# EAGLE design dimmer (EAGLE 7.7.0)
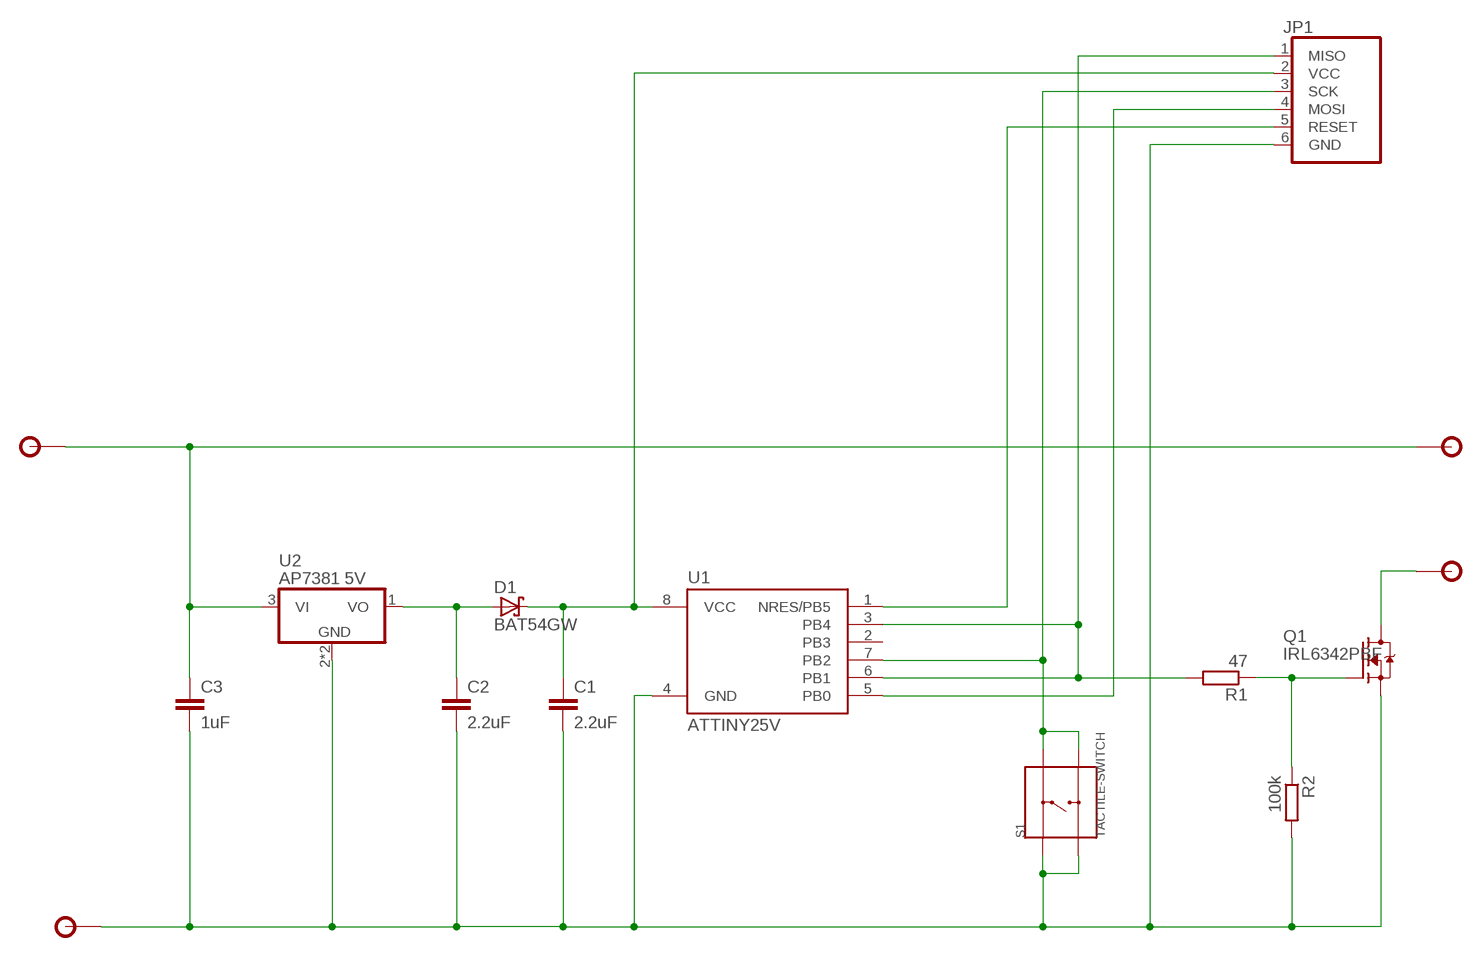
[diagram p0: schematic, sheet 1]

## Parts
C1  2.2uF  C-EUC0805  [C0805]
C2  2.2uF  C-EUC0805  [C0805]
C3  1uF  C-EUC0805  [C0805]
D1  BAT54GW  SCHOTKY  [SOD123FL]
JP1  AVR-ISP-6PIN  [2X03]
Q1  IRL6342PBF  [SO-8]
R1  47  R-EU_R0805  [R0805]
R2  100k  R-EU_R0805  [R0805]
S1  TACTILE-SWITCH  [SW4-SMD-4.5MM]
U1  ATTINY25V  ATTINY25V-10S  [SOIC8_EIAJ_208MIL]
U2  AP7381 5V  AP7381  [SOT89]
X1  PAD  [PAD-L]
X2  PAD  [PAD-L]
X3  PAD  [PAD-L]
X4  PAD  [PAD-L]

## Nets
BTN: JP1.3(SCK) S1.P$2(A1) S1.P$4(B1) U1.7(PB2)
GND: C1.2 C2.2 C3.2 JP1.6(GND) Q1.1(S) Q1.2(S) Q1.3(S) R2.2 S1.P$1(A0) S1.P$3(B0) U1.4(GND) U2.2(GND) U2.2@1(GND) X2.P$1
N$2: C2.1 D1.A U2.1(VO)
N$7: JP1.4(MOSI) U1.5(PB0)
N$8: JP1.5(RESET) U1.1(NRES/PB5)
N$10: Q1.4(G) R1.1 R2.1
OUT: Q1.5(D) Q1.6(D) Q1.7(D) Q1.8(D) X4.P$1
PWM: JP1.1(MISO) R1.2 U1.3(PB4) U1.6(PB1)
V+: C3.1 U2.3(VI) X1.P$1 X3.P$1
VCC: C1.1 D1.C JP1.2(VCC) U1.8(VCC)
Unconnected: U1.2(PB3)

## Library data of the parts
C1-C3 = rcl:C-EU: CAPACITOR, European symbol
D1 = cube:SCHOTKY
JP1 = cube:AVR-ISP-6PIN
Q1 = cube:IRL6342PBF
R1 R2 = rcl:R-EU_: RESISTOR, European symbol
S1 = cube:TACTILE-SWITCH
U1 = _hhn_attiny25_45_85:ATTINY25*: ATMEL ATtiny 25 Packages: P = PDIP 08 30mil S = SOIC 08 EIAJ 208mil SS = SOIC 08 JEDEC 150mil Technologies Note: for complete ordering code (temp. range, finish, tape&reel etc.) see www.atmel.com • Supply Voltage: V = (1.8…5.5)V | [blank] = (2.7…5.5)V • Speed: 10 = 10 MHz | 20 = 20 MHz Author: Dipl.-Ing. FH Rainer Bayer HHN Hochschule Heilbronn (Heilbronn University), rainer.bayer@hs-heilbronn.de Ingenieurbüro ing-rb, mail@ing-rb.de
U2 = cube:AP7381
X1-X4 = cube:PAD

## Board
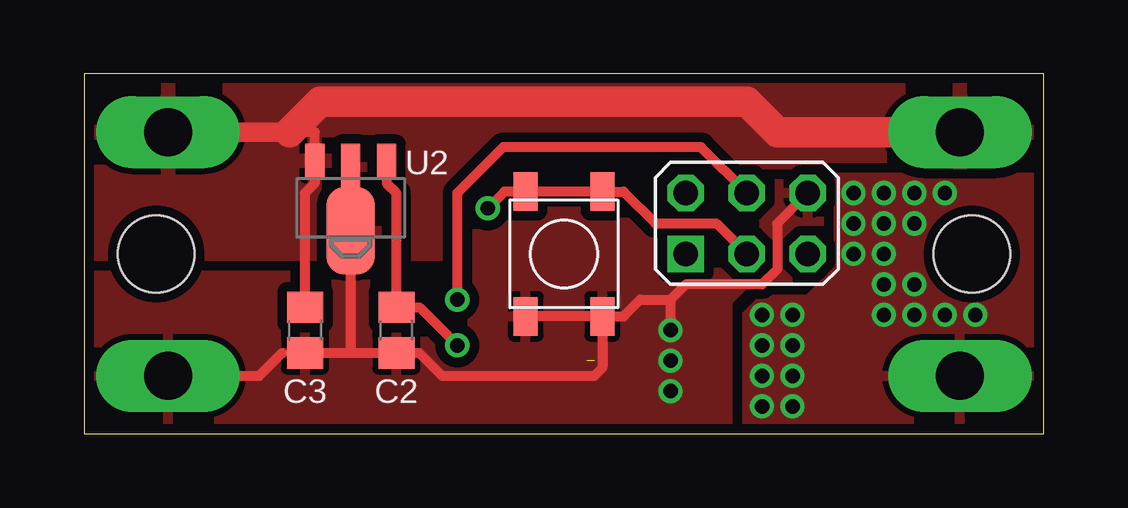
[diagram p1: board, top side]
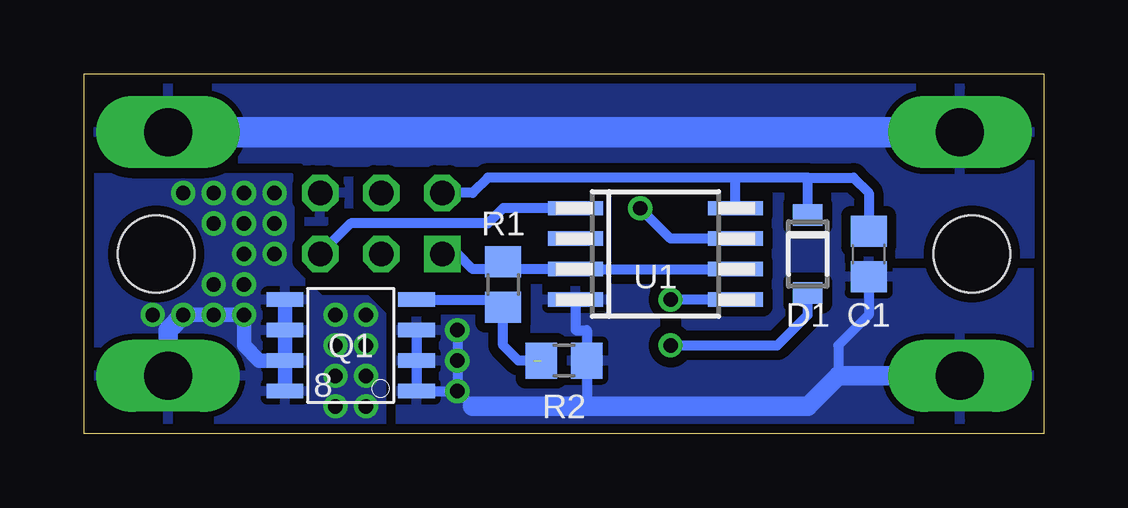
[diagram p2: board, bottom side, seen from below]

Size 40 x 15 mm. Coordinates in mm from the lower left corner, seen from the top.
Outline: 0,0 40,0 40,15 0,15 0,0
Copper layers (1*16): Top 0.035mm / dielectric 1.5mm / Bottom 0.035mm
Design rules "default *": minimum track width 5mil, minimum drill 0.3mm, track to track 5mil, track to pad 10mil, pad to pad 10mil, via to via 5mil, smd to smd 5mil, copper to edge 0.4mm, drill to drill 8mil, minimum pad ring 10mil, minimum via ring 8mil, stop-mask expansion 4mil, vias tented up to drill 0mil, thermal gap 10mil
Holes 3.2 mm at 37,7.5 3,7.5

### Footprints (pad centres in the part's own frame; a part is rotated, then mirrored left to right if it is on the bottom)
C0805 = smd 1.3 x 1.5: 1 -0.95,0; 2 0.95,0
SOD123FL = smd 0.91 x 1.22: A 1.625,0; C -1.625,0
2X03 = drill 1.016 square: 1 -2.54,-1.27 | drill 1.016 octagon: 2 -2.54,1.27; 3 0,-1.27; 4 0,1.27; 5 2.54,-1.27; 6 2.54,1.27
SO-8 = smd 1.524 x 0.61: 1 -2.743,1.905; 2 -2.743,0.635; 3 -2.743,-0.635; 4 -2.743,-1.905; 5 2.743,-1.905; 6 2.743,-0.635; 7 2.743,0.635; 8 2.743,1.905
R0805 = smd 1.3 x 1.5: 1 -0.95,0; 2 0.95,0
SW4-SMD-4.5MM = smd 1.6 x 1: P$1 -2.6,1.6; P$2 2.6,1.6; P$3 -2.6,-1.6; P$4 2.6,-1.6
SOIC8_EIAJ_208MIL = smd 0.6 x 2.286: 1 -1.905,-3.33; 2 -0.635,-3.33; 3 0.635,-3.33; 4 1.905,-3.33; 5 1.905,3.33; 6 0.635,3.33; 7 -0.635,3.33; 8 -1.905,3.33
SOT89 = smd 0.8 x 1.4: 1 -1.499,-1.981; 3 1.499,-1.981 | smd 0.8 x 1.9: 2 0,-1.727 | smd 2.032 x 3.65: 2@1 0,0.94
PAD-L = drill 2 pad 3 long: P$1 0,0

### Placement (x,y rotation side)
C1  7.3,7.5 270 bottom
C2  13.01,4.33 270 top
C3  9.21,4.33 270 top
D1  9.84,7.5 270 bottom
JP1  27.62,8.77 0 top
Q1  28.89,3.69 180 bottom
R1  22.54,6.23 90 bottom
R2  20,3.05 0 bottom
S1  20,7.5 90 top
U1  16.19,7.5 270 bottom
U2  11.11,9.41 180 top
X1  3.49,12.58 0 top
X2  3.49,2.42 0 top
X3  36.51,12.58 0 top
X4  36.51,2.42 0 top

### Tracks (layer width: path | path; a pad name or v marks a point on that pad's centre or on a via)
BTN  (via drill 0.6)
  Top 0.406: JP1.3 26.35,8.77 23.81,8.77 22.48,10.1 S1.P$4 S1.P$2 17.52,10.1 v16.83,9.41
  Bottom 0.406: U1.7 15.55,8.14 v16.83,9.41
GND  (via drill 0.6)
  Top 0.406: U2.2 U2.2@1 11.11,3.38 | S1.P$3 S1.P$1 | JP1.6 28.89,8.77 28.89,6.87 28.26,6.23 25.08,6.23 24.45,5.6 | 24.45,5.6 v24.45,4.33 | X2.P$1 7.3,2.42 8.25,3.38 | C3.2 11.11,3.38 | 11.11,3.38 C2.2 13.96,3.38 14.92,2.42 21.27,2.42 21.6,2.75 S1.P$3 | S1.P$3 22.48,4.9 23.17,5.6 24.45,5.6
  Bottom 0.406: Q1.3 Q1.2 Q1.1 v24.45,1.79 | v24.45,4.33 v24.45,3.05 v24.45,1.79 | v24.45,1.79 23.81,1.15 | 12.69,1.15 12.38,1.15 | C1.2 7.3,4.96 8.57,3.69 8.57,2.42 | 17.78,1.15 17.46,1.15 | U1.4 19.52,4.33 19.05,4.33 R2.2 19.05,1.15 18.73,1.15
  Bottom 0.813: X2.P$1 8.57,2.42 9.84,1.15 12.38,1.15 17.46,1.15 18.73,1.15 23.81,1.15
  pour Top (isolate 0.406, rank 3): -0.32,15.12 -0.32,-0.12 40.32,-0.12 40.32,15.12
  pour Bottom (isolate 0.406, rank 3): -0.32,15.12 -0.32,-0.12 40.32,-0.12 40.32,15.12
N$2  (via drill 0.6)
  Top 0.406: U2.1 12.61,10.45 13.01,10.04 C2.1 13.97,5.28 v15.55,3.69
  Bottom 0.406: v15.55,3.69 11.11,3.69 9.84,4.96 D1.A
N$7  (via drill 0.6)
  Top 0.406: JP1.4 25.71,11.95 17.46,11.95 15.55,10.04 v15.55,5.6
  Bottom 0.406: U1.5 v15.55,5.6
N$8
  Bottom 0.406: U1.1 22.54,9.41 23.17,8.77 28.89,8.77 JP1.5
N$10  (1 unrouted)
  Bottom 0.406: Q1.4 22.85,5.6 R1.1 22.54,3.69 21.91,3.05 21.27,3.05
OUT  (via drill 0.6)
  Bottom 0.61: Q1.5 Q1.6 Q1.7 | Q1.7 Q1.8 | Q1.7 32.7,3.05 33.34,3.69 v33.34,4.96 v35.88,4.96
  Bottom 0.813: X4.P$1 36.51,4.33 v35.88,4.96
  other vias: 28.26,4.96 29.52,4.96 28.26,3.69 29.52,3.69 28.26,2.42 29.52,2.42 34.61,4.96 37.15,4.96 33.34,8.77 33.34,7.5 33.34,6.23 34.61,6.23 33.34,10.04 34.61,10.04 34.61,8.77 35.88,10.04 32.07,10.04 32.07,8.77 32.07,7.5 28.26,1.15 29.52,1.15
  pour Bottom (isolate 0.406): 40.32,10.68 31.43,10.68 31.43,6.87 30.16,5.6 28.26,5.6 27.62,4.96 27.62,-0.12 40.32,-0.12
  pour Top (isolate 0.406): 40.32,10.68 31.43,10.68 31.43,6.87 30.16,5.6 28.26,5.6 27.62,4.96 27.62,-0.12 40.32,-0.12
PWM
  Bottom 0.406: U1.6 U1.3 22.54,6.87 | 22.54,6.87 23.81,6.87 24.45,7.5 JP1.1 | R1.2 22.54,6.87
V+
  Top 0.406: 8.25,12.58 8.57,12.58 9.61,12.58 U2.3 9.61,10.45 9.21,10.04 C3.1
  Top 0.813: 8.57,12.58 X1.P$1
  Top 1.27: 8.57,12.58 9.84,13.85 27.62,13.85 28.89,12.58 X3.P$1
  Bottom 1.27: X3.P$1 X1.P$1
  pour Bottom (isolate 0.4, rank 2): -0.32,15.12 -0.32,7.5 7.3,7.5 7.3,11.31 42.86,11.31 42.86,15.12
  pour Top (isolate 0.4, rank 2): -0.32,15.12 -0.32,7.5 15.55,7.5 15.55,11.31 42.86,11.31 42.86,15.12
VCC
  Bottom 0.406: 9.84,10.68 7.94,10.68 7.3,10.04 C1.1 | D1.C 9.84,10.68 | 9.84,10.68 12.86,10.68 | U1.8 12.86,10.68 | 12.86,10.68 23.17,10.68 23.81,10.04 JP1.2

### Text on the board
tDocu: 5V-24V, 5A | OUT + | +IN - | OUT -
bDocu: https://github.com/bluecube/dimmer v1.0